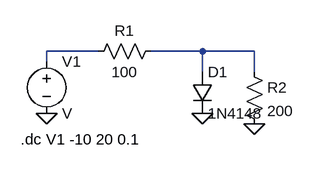
[diagram p0: schematic AEkg1.asc]
AEkg1.asc, the LTspice schematic file:
Version 4
SHEET 1 880 680
WIRE 144 112 64 112
WIRE 304 112 224 112
WIRE 384 112 304 112
WIRE 64 128 64 112
WIRE 304 144 304 112
WIRE 384 144 384 112
FLAG 64 208 0
FLAG 304 208 0
FLAG 384 224 0
SYMBOL res 240 96 R90
WINDOW 0 0 56 VBottom 2
WINDOW 3 32 56 VTop 2
SYMATTR InstName R1
SYMATTR Value 100
SYMBOL res 368 128 R0
SYMATTR InstName R2
SYMATTR Value 200
SYMBOL voltage 64 112 R0
SYMATTR InstName V1
SYMBOL diode 288 144 R0
SYMATTR InstName D1
SYMATTR Value 1N4148
TEXT 24 248 Left 2 !.dc V1 -10 20 0.1

The netlist it stands for:
* AEkg1.asc
R1 N002 N001 100
R2 N002 0 200
V1 N001 0 V
D1 N002 0 1N4148
.model D D
.lib standard.dio
.dc V1 -10 20 0.1
.backanno
.end